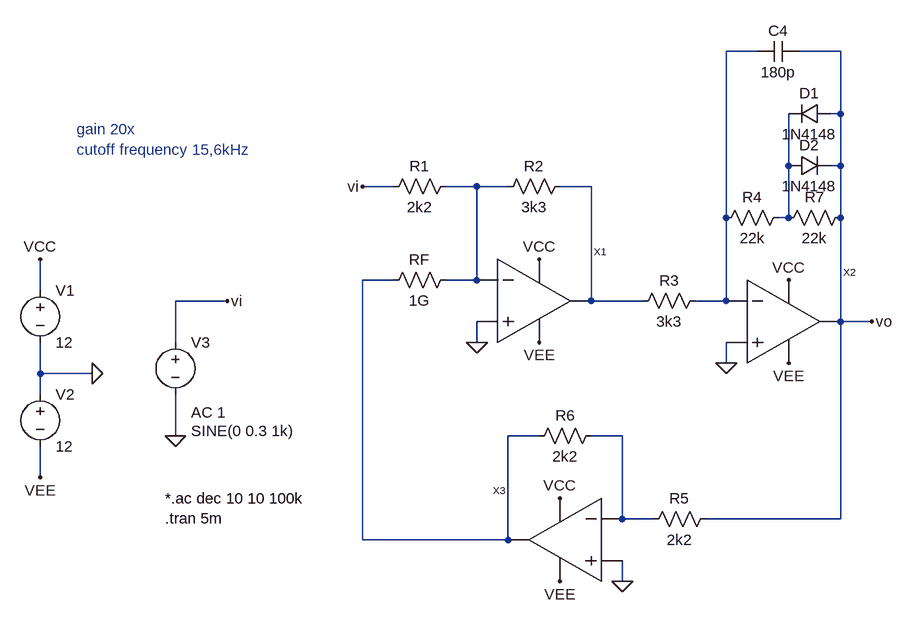
[diagram p0: schematic Perc-02-03-noFB.asc]
Perc-02-03-noFB.asc, the LTspice schematic file:
Version 4
SHEET 1 1340 680
WIRE 1120 -336 1072 -336
WIRE 1248 -336 1184 -336
WIRE 1248 -240 1248 -336
WIRE 1248 -240 1232 -240
WIRE 1168 -160 1168 -240
WIRE 1248 -160 1248 -240
WIRE 1248 -160 1232 -160
WIRE 560 -128 512 -128
WIRE 688 -128 640 -128
WIRE 736 -128 688 -128
WIRE 864 -128 816 -128
WIRE 1072 -80 1072 -336
WIRE 1168 -80 1168 -160
WIRE 1168 -80 1152 -80
WIRE 1248 -80 1248 -160
WIRE 560 16 512 16
WIRE 688 16 688 -128
WIRE 688 16 640 16
WIRE 16 32 16 -16
WIRE 304 48 224 48
WIRE 864 48 864 -128
WIRE 944 48 864 48
WIRE 1072 48 1072 -80
WIRE 1072 48 1024 48
WIRE 1248 80 1248 -80
WIRE 1248 80 1232 80
WIRE 1296 80 1248 80
WIRE 224 112 224 48
WIRE 688 112 688 80
WIRE 1072 144 1072 112
WIRE 16 160 16 112
WIRE 96 160 16 160
WIRE 16 192 16 160
WIRE 224 256 224 192
WIRE 784 256 736 256
WIRE 912 256 864 256
WIRE 16 320 16 272
WIRE 912 384 912 256
WIRE 960 384 912 384
WIRE 1248 384 1248 80
WIRE 1248 384 1040 384
WIRE 512 416 512 16
WIRE 736 416 736 256
WIRE 736 416 512 416
WIRE 912 480 912 448
FLAG 16 -16 VCC
FLAG 16 320 VEE
FLAG 96 160 0
FLAG 784 -16 VCC
FLAG 1168 16 VCC
FLAG 816 352 VCC
FLAG 816 480 VEE
FLAG 784 112 VEE
FLAG 1168 144 VEE
FLAG 688 112 0
FLAG 1072 144 0
FLAG 912 480 0
FLAG 1296 80 vo
FLAG 512 -128 vi
FLAG 304 48 vi
FLAG 224 256 0
SYMBOL voltage 16 16 R0
SYMATTR InstName V1
SYMATTR Value 12
SYMBOL voltage 16 176 R0
SYMATTR InstName V2
SYMATTR Value 12
SYMBOL Opampku 768 48 R0
SYMATTR InstName X1
SYMBOL Opampku 1152 80 R0
SYMATTR InstName X2
SYMBOL Opampku 832 416 M0
SYMATTR InstName X3
SYMBOL res 832 -144 R90
WINDOW 0 0 56 VBottom 2
WINDOW 3 32 56 VTop 2
SYMATTR InstName R2
SYMATTR Value 3k3
SYMBOL res 880 240 R90
WINDOW 0 0 56 VBottom 2
WINDOW 3 32 56 VTop 2
SYMATTR InstName R6
SYMATTR Value 2k2
SYMBOL res 656 0 R90
WINDOW 0 0 56 VBottom 2
WINDOW 3 32 56 VTop 2
SYMATTR InstName RF
SYMATTR Value 1G
SYMBOL res 1040 32 R90
WINDOW 0 0 56 VBottom 2
WINDOW 3 32 56 VTop 2
SYMATTR InstName R3
SYMATTR Value 3k3
SYMBOL res 1056 368 R90
WINDOW 0 0 56 VBottom 2
WINDOW 3 32 56 VTop 2
SYMATTR InstName R5
SYMATTR Value 2k2
SYMBOL res 656 -144 R90
WINDOW 0 0 56 VBottom 2
WINDOW 3 32 56 VTop 2
SYMATTR InstName R1
SYMATTR Value 2k2
SYMBOL cap 1184 -352 R90
WINDOW 0 0 32 VBottom 2
WINDOW 3 32 32 VTop 2
SYMATTR InstName C4
SYMATTR Value 180p
SYMBOL voltage 224 96 R0
WINDOW 3 24 152 Left 2
WINDOW 123 24 124 Left 2
WINDOW 39 0 0 Left 0
SYMATTR Value SINE(0 0.3 1k)
SYMATTR Value2 AC 1
SYMATTR InstName V3
SYMBOL res 1168 -96 R90
WINDOW 0 0 56 VBottom 2
WINDOW 3 32 56 VTop 2
SYMATTR InstName R4
SYMATTR Value 22k
SYMBOL res 1264 -96 R90
WINDOW 0 0 56 VBottom 2
WINDOW 3 32 56 VTop 2
SYMATTR InstName R7
SYMATTR Value 22k
SYMBOL diode 1232 -256 R90
WINDOW 0 0 32 VBottom 2
WINDOW 3 32 32 VTop 2
SYMATTR InstName D1
SYMATTR Value 1N4148
SYMBOL diode 1168 -144 R270
WINDOW 0 32 32 VTop 2
WINDOW 3 0 32 VBottom 2
SYMATTR InstName D2
SYMATTR Value 1N4148
TEXT 72 -216 Left 2 ;gain 20x\ncutoff frequency 15,6kHz
TEXT 208 352 Left 2 !*.ac dec 10 10 100k\n.tran 5m

The netlist it stands for:
* Perc-02-03-noFB.asc
V1 VCC 0 12
V2 0 VEE 12
XX1 N003 0 VCC VEE N004 Opampku  ; pins inn inp vp vn out
XX2 N001 0 VCC VEE vo Opampku  ; pins inn inp vp vn out
XX3 N006 0 VCC VEE N005 Opampku  ; pins inn inp vp vn out
R2 N004 N003 3k3
R6 N006 N005 2k2
RF N003 N005 1G
R3 N001 N004 3k3
R5 vo N006 2k2
R1 N003 vi 2k2
C4 vo N001 180p
V3 vi 0 SINE(0 0.3 1k) AC 1
R4 N002 N001 22k
R7 vo N002 22k
D1 vo N002 1N4148
D2 N002 vo 1N4148
.model D D
.lib standard.dio
* gain 20x
* cutoff frequency 15,6kHz
*.ac dec 10 10 100k
.tran 5m
.backanno
.end